# Altium project BMA_Projektv1.PrjPcb
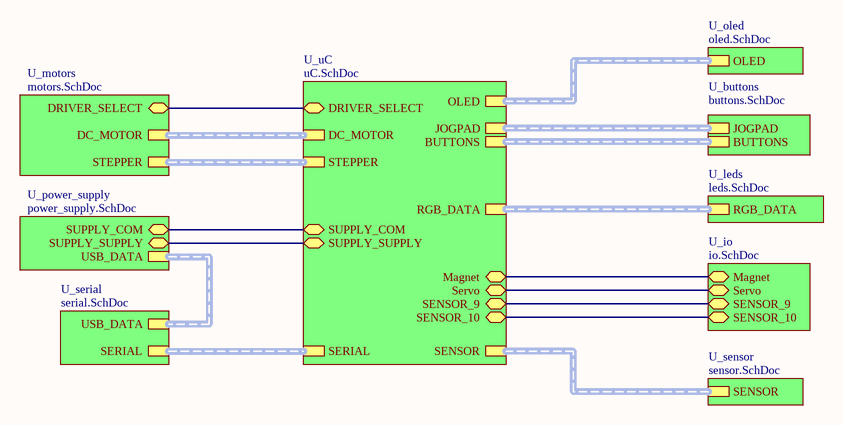
[diagram p0: BMAv1.0.SchDoc]
10 sheets, 159 parts. Net scope: hierarchical (ports join the sheet entries above them; power ports are global).
Board file: BMA_pcbv1.0.PcbDoc
Sheets:
  BMAv1.0.SchDoc
    U_uC = uC.SchDoc
    U_buttons = buttons.SchDoc
    U_io = io.SchDoc
    U_leds = leds.SchDoc
    U_motors = motors.SchDoc
    U_oled = oled.SchDoc
    U_power_supply = power_supply.SchDoc
    U_sensor = sensor.SchDoc
    U_serial = serial.SchDoc

## Sheet BMAv1.0.SchDoc
size A3

### Sub-sheets
U_buttons = buttons.SchDoc: BUTTONS (harness BUTTONS), JOGPAD (harness JOGPAD)
U_io = io.SchDoc: Magnet (bidir), Servo (bidir), SENSOR_9 (bidir), SENSOR_10 (bidir)
U_leds = leds.SchDoc: RGB_DATA (harness RGB_DATA)
U_motors = motors.SchDoc: DC_MOTOR (harness DC_MOTOR), STEPPER (harness STEPPER), DRIVER_SELECT (bidir)
U_oled = oled.SchDoc: OLED (harness OLED)
U_power_supply = power_supply.SchDoc: USB_DATA (harness USB_DATA), SUPPLY_SUPPLY (bidir), SUPPLY_COM (bidir)
U_sensor = sensor.SchDoc: SENSOR (harness SENSOR)
U_serial = serial.SchDoc: SERIAL (harness SERIAL), USB_DATA (harness USB_DATA)
U_uC = uC.SchDoc: STEPPER (harness STEPPER), DRIVER_SELECT (bidir), OLED (harness OLED), DC_MOTOR (harness DC_MOTOR), SUPPLY_COM (bidir), SUPPLY_SUPPLY (bidir), JOGPAD (harness JOGPAD), BUTTONS (harness BUTTONS), SERIAL (harness SERIAL), RGB_DATA (harness RGB_DATA), Magnet (bidir), Servo (bidir), SENSOR (harness SENSOR), SENSOR_9 (bidir), SENSOR_10 (bidir)

### Nets
NetC12_2: sheet U_uC/SENSOR_9, sheet U_io/SENSOR_9
NetC13_2: sheet U_uC/SENSOR_10, sheet U_io/SENSOR_10
NetP3_3: sheet U_uC/Magnet, sheet U_io/Magnet
NetP3_4: sheet U_uC/Servo, sheet U_io/Servo
NetP8_2: sheet U_uC/DRIVER_SELECT, sheet U_motors/DRIVER_SELECT
NetP23_1: sheet U_uC/SUPPLY_COM, sheet U_power_supply/SUPPLY_COM
NetP23_2: sheet U_uC/SUPPLY_SUPPLY, sheet U_power_supply/SUPPLY_SUPPLY

### Buses and harness runs
harness sheet U_buttons/BUTTONS = sheet U_uC/BUTTONS
harness sheet U_buttons/JOGPAD = sheet U_uC/JOGPAD
harness sheet U_leds/RGB_DATA = sheet U_uC/RGB_DATA
harness sheet U_motors/DC_MOTOR = sheet U_uC/DC_MOTOR
harness sheet U_motors/STEPPER = sheet U_uC/STEPPER
harness sheet U_oled/OLED = sheet U_uC/OLED
harness sheet U_power_supply/USB_DATA = sheet U_serial/USB_DATA
harness sheet U_sensor/SENSOR = sheet U_uC/SENSOR
harness sheet U_serial/SERIAL = sheet U_uC/SERIAL

### Notes on the sheet
- 1
- 2
- 3
- 4
- 5
- 6
- 7
- 8
- A
- B
- C
- D
- Project:
- Date:
- Drawing number:
- Rev:
- Format:
- A3
- Drawn by:
- Laboratory:
- Page
- Sheet:
- of
- File:

## Sheet uC.SchDoc
size A3
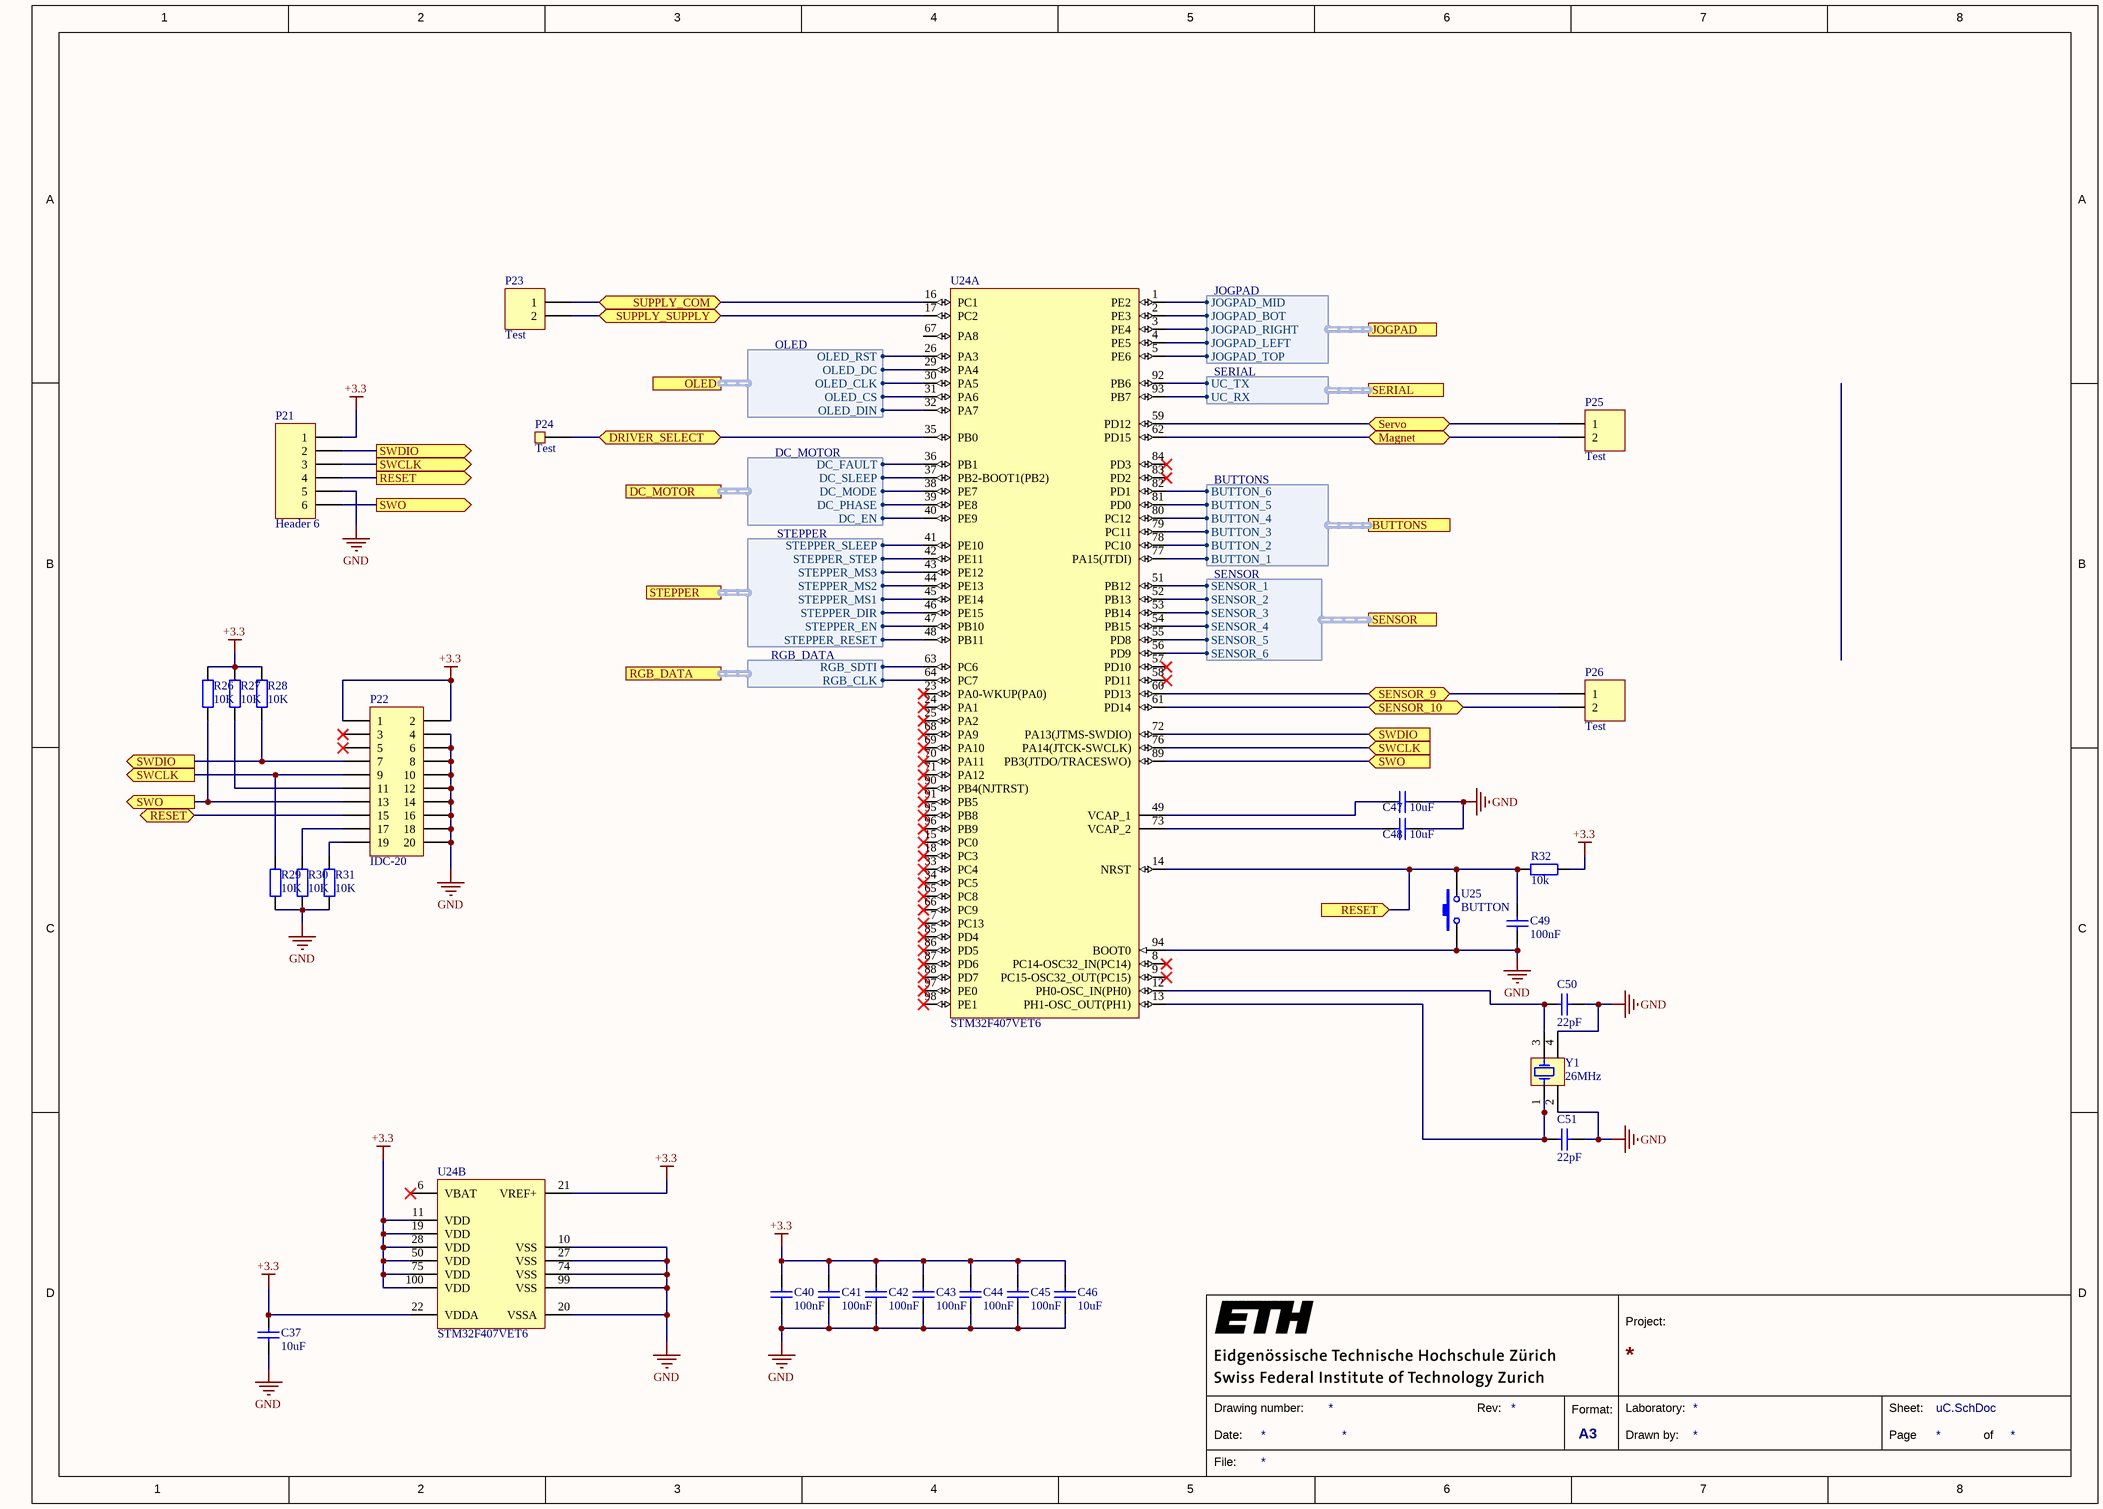
[diagram p1: uC.SchDoc]

### Parts
C37  10uF  [CAP_0603i_1608m -N]
C40  100nF  [CAP_0402i_1005m -N]
C41  100nF  [CAP_0402i_1005m -N]
C42  100nF  [CAP_0402i_1005m -N]
C43  100nF  [CAP_0402i_1005m -N]
C44  100nF  [CAP_0402i_1005m -N]
C45  100nF  [CAP_0402i_1005m -N]
C46  10uF  [CAP_0603i_1608m -N]
C47  10uF  [CAP_0603i_1608m -N]
C48  10uF  [CAP_0603i_1608m -N]
C49  100nF  [CAP_0402i_1005m -N]
C50  22pF  [CAP_0603i_1608m -N]
C51  22pF  [CAP_0603i_1608m -N]
P21  Header 6  [HDR1X6]
P22  IDC-20  [IDC-20]
P23  Test  [HDR1X2]
P24  Test  [PIN1]
P25  Test  [HDR1X2]
P26  Test  [HDR1X2]
R26  10K  [RES_0603i_1608m -N]
R27  10K  [RES_0603i_1608m -N]
R28  10K  [RES_0603i_1608m -N]
R29  10K  [RES_0603i_1608m -N]
R30  10K  [RES_0603i_1608m -N]
R31  10K  [RES_0603i_1608m -N]
R32  10k  [RES_0603i_1608m -N]
U24  STM32F407VET6  [STM-LQFP100_M]  (parts A,B of 2)
U25  BUTTON  [RND 210-00206]
Y1  26MHz  [TSX-3225 2*2.5]

### Ports
BUTTONS (harness BUTTONS), DC_MOTOR (harness DC_MOTOR), DRIVER_SELECT (bidir), JOGPAD (harness JOGPAD), Magnet (bidir), OLED (harness OLED), RESET (bidir), RESET (in), RESET (out), RGB_DATA (harness RGB_DATA), SENSOR (harness SENSOR), SENSOR_9 (bidir), SENSOR_10 (bidir), SERIAL (harness SERIAL), Servo (bidir), STEPPER (harness STEPPER), SUPPLY_COM (bidir), SUPPLY_SUPPLY (bidir), SWCLK (in), SWCLK (out), SWDIO (in), SWDIO (out), SWO (in), SWO (out)

### Harnesses
SENSOR: SENSOR_1, SENSOR_2, SENSOR_3, SENSOR_4, SENSOR_5, SENSOR_6
STEPPER: STEPPER_EN, STEPPER_STEP, STEPPER_MS1, STEPPER_MS2, STEPPER_MS3, STEPPER_DIR, STEPPER_RESET, STEPPER_SLEEP
DC_MOTOR: DC_SLEEP, DC_EN, DC_MODE, DC_PHASE, DC_FAULT
OLED: OLED_DIN, OLED_CLK, OLED_CS, OLED_DC, OLED_RST
JOGPAD: JOGPAD_TOP, JOGPAD_LEFT, JOGPAD_RIGHT, JOGPAD_BOT, JOGPAD_MID
BUTTONS: BUTTON_4, BUTTON_5, BUTTON_3, BUTTON_2, BUTTON_1, BUTTON_6
SERIAL: UC_RX, UC_TX
RGB_DATA: RGB_SDTI, RGB_CLK

### Nets
+3.3: C37.2 C40.1 C41.2 C42.2 C43.2 C44.2 C45.2 C46.2 P21.1 P22.1 P22.2 R26.2 R27.2 R28.2 R32.1 U24.11(VDD) U24.19(VDD) U24.21(VREF+) U24.22(VDDA) U24.28(VDD) U24.50(VDD) U24.75(VDD) U24.100(VDD)
GND: C37.1 C40.2 C41.1 C42.1 C43.1 C44.1 C45.1 C46.1 C47.1 C48.1 C49.1 C50.1 C51.1 P21.5 P22.4 P22.6 P22.8 P22.10 P22.12 P22.14 P22.16 P22.18 P22.20 R29.1 R30.1 R31.1 U24.10(VSS) U24.20(VSSA) U24.27(VSS) U24.74(VSS) U24.94(BOOT0) U24.99(VSS) U25.1 Y1.2(COM) Y1.4(COM)
NetC1_2: U24.1(PE2) ; port JOGPAD.JOGPAD_MID
NetC2_2: U24.2(PE3) ; port JOGPAD.JOGPAD_BOT
NetC3_2: U24.3(PE4) ; port JOGPAD.JOGPAD_RIGHT
NetC4_2: U24.4(PE5) ; port JOGPAD.JOGPAD_LEFT
NetC5_2: U24.5(PE6) ; port JOGPAD.JOGPAD_TOP
NetC6_2: U24.82(PD1) ; port BUTTONS.BUTTON_6
NetC7_2: U24.81(PD0) ; port BUTTONS.BUTTON_5
NetC8_2: U24.80(PC12) ; port BUTTONS.BUTTON_4
NetC9_2: U24.79(PC11) ; port BUTTONS.BUTTON_3
NetC10_2: U24.78(PC10) ; port BUTTONS.BUTTON_2
NetC11_2: U24.77(PA15(JTDI)) ; port BUTTONS.BUTTON_1
NetC12_2: P26.1 U24.60(PD13) ; port SENSOR_9
NetC13_2: P26.2 U24.61(PD14) ; port SENSOR_10
NetC29_2: U24.56(PD9) ; port SENSOR.SENSOR_6
NetC30_2: U24.55(PD8) ; port SENSOR.SENSOR_5
NetC31_2: U24.54(PB15) ; port SENSOR.SENSOR_4
NetC32_2: U24.53(PB14) ; port SENSOR.SENSOR_3
NetC33_2: U24.52(PB13) ; port SENSOR.SENSOR_2
NetC34_2: U24.51(PB12) ; port SENSOR.SENSOR_1
NetC47_2: C47.2 U24.49(VCAP_1)
NetC48_2: C48.2 U24.73(VCAP_2)
NetC49_2: C49.2 P21.4 P22.15 R32.2 U24.14(NRST) U25.2 ; port RESET
NetC50_2: C50.2 U24.12(PH0-OSC_IN(PH0)) Y1.3(OSC2)
NetC51_2: C51.2 U24.13(PH1-OSC_OUT(PH1)) Y1.1(OSC1)
NetIC1_1: U24.93(PB7) ; port SERIAL.UC_RX
NetIC1_5: U24.92(PB6) ; port SERIAL.UC_TX
NetP3_3: P25.2 U24.62(PD15) ; port Magnet
NetP3_4: P25.1 U24.59(PD12) ; port Servo
NetP5_1: U24.63(PC6) ; port RGB_DATA.RGB_SDTI
NetP5_2: U24.64(PC7) ; port RGB_DATA.RGB_CLK
NetP8_2: P24.1 U24.35(PB0) ; port DRIVER_SELECT
NetP21_2: P21.2 P22.7 R28.1 U24.72(PA13(JTMS-SWDIO)) ; port SWDIO
NetP21_3: P21.3 P22.9 R29.2 U24.76(PA14(JTCK-SWCLK)) ; port SWCLK
NetP21_6: P21.6 P22.13 R26.1 U24.89(PB3(JTDO/TRACESWO)) ; port SWO
NetP22_11: P22.11 R27.1
NetP22_17: P22.17 R30.2
NetP22_19: P22.19 R31.2
NetP23_1: P23.1 U24.16(PC1) ; port SUPPLY_COM
NetP23_2: P23.2 U24.17(PC2) ; port SUPPLY_SUPPLY
NetP27_3: U24.32(PA7) ; port OLED.OLED_DIN
NetP27_4: U24.30(PA5) ; port OLED.OLED_CLK
NetP27_5: U24.31(PA6) ; port OLED.OLED_CS
NetP27_6: U24.29(PA4) ; port OLED.OLED_DC
NetP27_7: U24.26(PA3) ; port OLED.OLED_RST
NetR3_1: U24.36(PB1) ; port DC_MOTOR.DC_FAULT
NetR6_1: U24.37(PB2-BOOT1(PB2)) ; port DC_MOTOR.DC_SLEEP
NetU14_2: U24.38(PE7) ; port DC_MOTOR.DC_MODE
NetU14_3: U24.39(PE8) ; port DC_MOTOR.DC_PHASE
NetU14_6: U24.40(PE9) ; port DC_MOTOR.DC_EN
NetU15_1: U24.47(PB10) ; port STEPPER.STEPPER_EN
NetU15_2: U24.45(PE14) ; port STEPPER.STEPPER_MS1
NetU15_3: U24.44(PE13) ; port STEPPER.STEPPER_MS2
NetU15_4: U24.43(PE12) ; port STEPPER.STEPPER_MS3
NetU15_5: U24.48(PB11) ; port STEPPER.STEPPER_RESET
NetU15_6: U24.41(PE10) ; port STEPPER.STEPPER_SLEEP
NetU15_7: U24.42(PE11) ; port STEPPER.STEPPER_STEP
NetU15_8: U24.46(PE15) ; port STEPPER.STEPPER_DIR

Not connected (* = marked no-connect by the designer): P22 3* 5*; U24 6(VBAT)* 7(PC13)* 8(PC14-OSC32_IN(PC14))* 9(PC15-OSC32_OUT(PC15))* 15(PC0)* 18(PC3)* 23(PA0-WKUP(PA0))* 24(PA1)* 25(PA2)* 33(PC4)* 34(PC5)* 57(PD10)* 58(PD11)* 65(PC8)* 66(PC9)* 67(PA8) 68(PA9)* 69(PA10)* 70(PA11)* 71(PA12)* 83(PD2)* 84(PD3)* 85(PD4)* 86(PD5)* 87(PD6)* 88(PD7)* 90(PB4(NJTRST))* 91(PB5)* 95(PB8)* 96(PB9)* 97(PE0)* 98(PE1)*

### Notes on the sheet
- 1
- 2
- 3
- 4
- 5
- 6
- 7
- 8
- A
- B
- C
- D
- Project:
- Date:
- Drawing number:
- Rev:
- Format:
- A3
- Drawn by:
- Laboratory:
- Page
- Sheet:
- of
- File:

### Library data of the parts
C37 C40-C51 = Cap: capacitor
P21 = Header 6: Header, 6-Pin
P22 = IDC-20: Connector; IDC, Male Header, Thru-Hole; 20 Position; Vertical; Pitch 2.54 mm; B
P23 P25 P26 = Header 2: Header, 2-Pin
P24 = Pad: Single Pad or Testpoint
R26-R32 = Res: Resistor
U24 = CMP-0243-00016-3: ARM Cortex-M4 32-bit MCU+FPU, 210 DMIPS, 512 kB Flash, 192 kB Internal RAM, 82 I/Os, 100-pin LQFP, -40 to 85 degC, Tray; Manufacturer: STMicroelectronics; Supply Voltage(Vcc) max (V): 3.6; Supply Voltage(Vcc) min (V): 1.8; I/Os (High Current): 82; FLASH Size (Prog) (kB): 512; Operating Frequency(F) (Processor speed) (MHz): 168; D/A Converter: 2x12-bit; Internal RAM Size (kB): 192; PackageReference: LQFP100; Core: ARM Cortex-M4; ComponentLink1URL: http://www.st.com/web/en/home.html; ComponentLink1Description: Manufacturer URL; DatasheetVersion: Rev. 4; Packing: Tray; Mounting Technology: Surface Mount; ComponentLink2Description: Datasheet; ComponentLink2URL: http://www.st.com/st-web-ui/static/active/en/resource/technical/document/datasheet/DM00037051.pdf; ComponentLink3Description: Package Specification; PartNumber: STM32F407VET6; PackageVersion: Rev. 1, 06/2013; PackageDescription: 100-Pin Low Profile Quad Flat Package, 14 x 14 mm Body, 0.5 mm Pitch; ComponentLink3URL: http://www.st.com/st-web-ui/static/active/en/resource/technical/document/data_brief/DM00071938.pdf
Y1 = XTAL3: Industrial Ceramic Resonator

## Sheet buttons.SchDoc
size A3
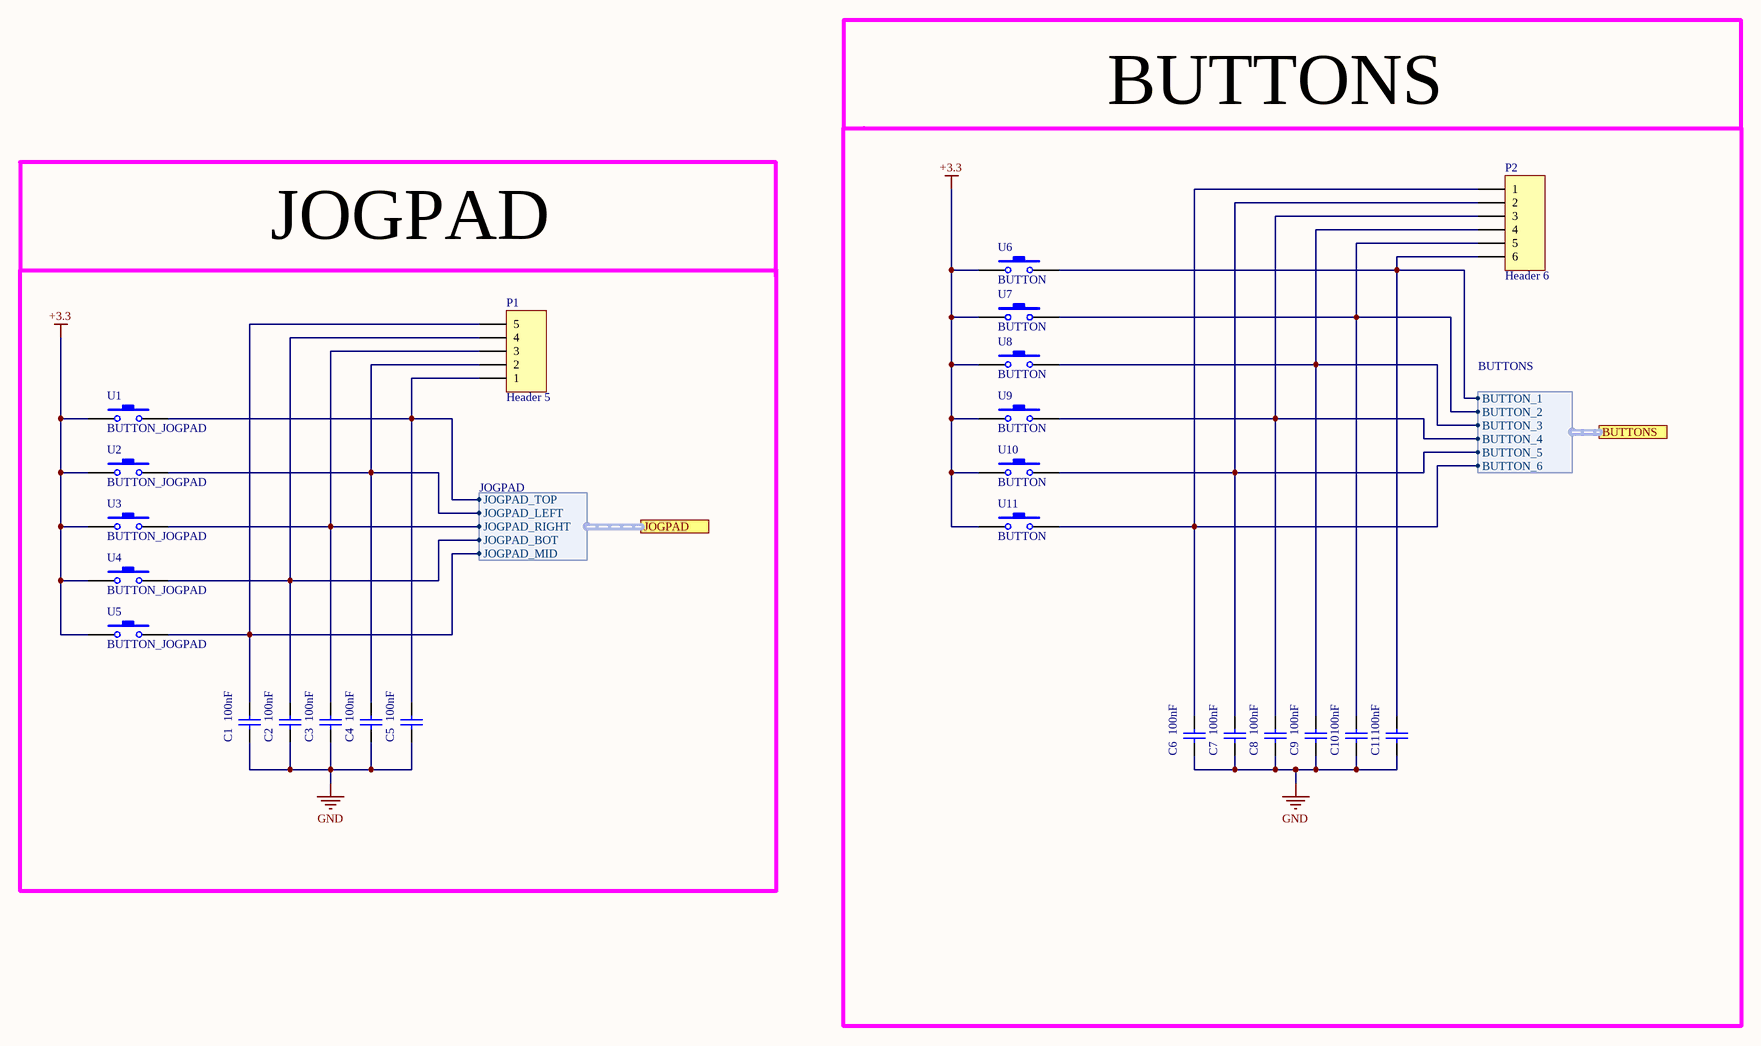
[diagram p2: buttons.SchDoc]

### Parts
C1  100nF  [CAP_0402i_1005m -N]
C2  100nF  [CAP_0402i_1005m -N]
C3  100nF  [CAP_0402i_1005m -N]
C4  100nF  [CAP_0402i_1005m -N]
C5  100nF  [CAP_0402i_1005m -N]
C6  100nF  [CAP_0402i_1005m -N]
C7  100nF  [CAP_0402i_1005m -N]
C8  100nF  [CAP_0402i_1005m -N]
C9  100nF  [CAP_0402i_1005m -N]
C10  100nF  [CAP_0402i_1005m -N]
C11  100nF  [CAP_0402i_1005m -N]
P1  Header 5  [HDR1X5]
P2  Header 6  [HDR1X6]
U1  BUTTON_JOGPAD  [JOGPAD_Button]
U2  BUTTON_JOGPAD  [JOGPAD_Button]
U3  BUTTON_JOGPAD  [JOGPAD_Button]
U4  BUTTON_JOGPAD  [JOGPAD_Button]
U5  BUTTON_JOGPAD  [JOGPAD_Button]
U6  BUTTON  [RND 210-00206]
U7  BUTTON  [RND 210-00206]
U8  BUTTON  [RND 210-00206]
U9  BUTTON  [RND 210-00206]
U10  BUTTON  [RND 210-00206]
U11  BUTTON  [RND 210-00206]

### Blocks framed on the sheet
BUTTONS: C6-C11 P2 U6-U11
JOGPAD: C1-C5 P1 U1-U5

### Ports
BUTTONS (harness BUTTONS), JOGPAD (harness JOGPAD)

### Harnesses
BUTTONS: BUTTON_4, BUTTON_5, BUTTON_3, BUTTON_2, BUTTON_1, BUTTON_6
JOGPAD: JOGPAD_TOP, JOGPAD_LEFT, JOGPAD_RIGHT, JOGPAD_BOT, JOGPAD_MID

### Nets
+3.3: U1.1 U2.1 U3.1 U4.1 U5.1 U6.1 U7.1 U8.1 U9.1 U10.1 U11.1
GND: C1.1 C2.1 C3.1 C4.1 C5.1 C6.1 C7.1 C8.1 C9.1 C10.1 C11.1
NetC1_2: C1.2 P1.5 U5.2 ; port JOGPAD.JOGPAD_MID
NetC2_2: C2.2 P1.4 U4.2 ; port JOGPAD.JOGPAD_BOT
NetC3_2: C3.2 P1.3 U3.2 ; port JOGPAD.JOGPAD_RIGHT
NetC4_2: C4.2 P1.2 U2.2 ; port JOGPAD.JOGPAD_LEFT
NetC5_2: C5.2 P1.1 U1.2 ; port JOGPAD.JOGPAD_TOP
NetC6_2: C6.2 P2.1 U11.2 ; port BUTTONS.BUTTON_6
NetC7_2: C7.2 P2.2 U10.2 ; port BUTTONS.BUTTON_5
NetC8_2: C8.2 P2.3 U9.2 ; port BUTTONS.BUTTON_4
NetC9_2: C9.2 P2.4 U8.2 ; port BUTTONS.BUTTON_3
NetC10_2: C10.2 P2.5 U7.2 ; port BUTTONS.BUTTON_2
NetC11_2: C11.2 P2.6 U6.2 ; port BUTTONS.BUTTON_1

### Notes on the sheet
- 1
- 2
- 3
- 4
- 5
- 6
- 7
- 8
- A
- B
- C
- D
- Project:
- Date:
- Drawing number:
- Rev:
- Format:
- A3
- Drawn by:
- Laboratory:
- Page
- Sheet:
- of
- File:

### Library data of the parts
C1-C11 = Cap: capacitor
P1 = Header 5: Header, 5-Pin
P2 = Header 6: Header, 6-Pin

## Sheet io.SchDoc
size A3
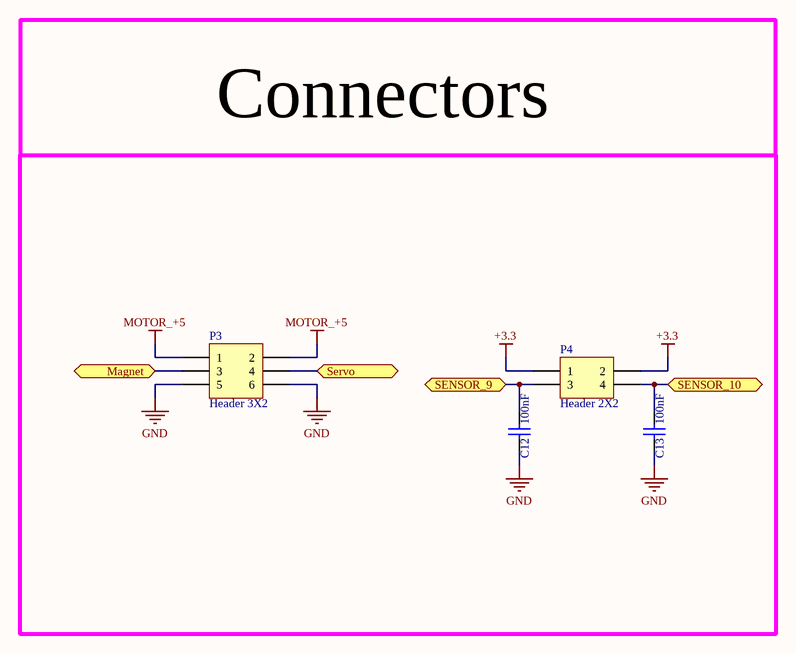
[diagram p3: io.SchDoc]

### Parts
C12  100nF  [CAP_0402i_1005m -N]
C13  100nF  [CAP_0402i_1005m -N]
P3  Header 3X2  [HDR2X3]
P4  Header 2X2  [HDR2X2]

### Ports
Magnet (bidir), SENSOR_9 (bidir), SENSOR_10 (bidir), Servo (bidir)

### Nets
+3.3: P4.1 P4.2
GND: C12.1 C13.1 P3.5 P3.6
MOTOR_+5: P3.1 P3.2
NetC12_2: C12.2 P4.3 ; port SENSOR_9
NetC13_2: C13.2 P4.4 ; port SENSOR_10
NetP3_3: P3.3 ; port Magnet
NetP3_4: P3.4 ; port Servo

### Notes on the sheet
- Connectors
- 1
- 2
- 3
- 4
- 5
- 6
- 7
- 8
- A
- B
- C
- D
- Project:
- Date:
- Drawing number:
- Rev:
- Format:
- A3
- Drawn by:
- Laboratory:
- Page
- Sheet:
- of
- File:

### Library data of the parts
C12 C13 = Cap: capacitor
P3 = Header 3X2: Header, 3-Pin, Dual row
P4 = Header 2X2: Header, 2-Pin, Dual row

## Sheet leds.SchDoc
size A3
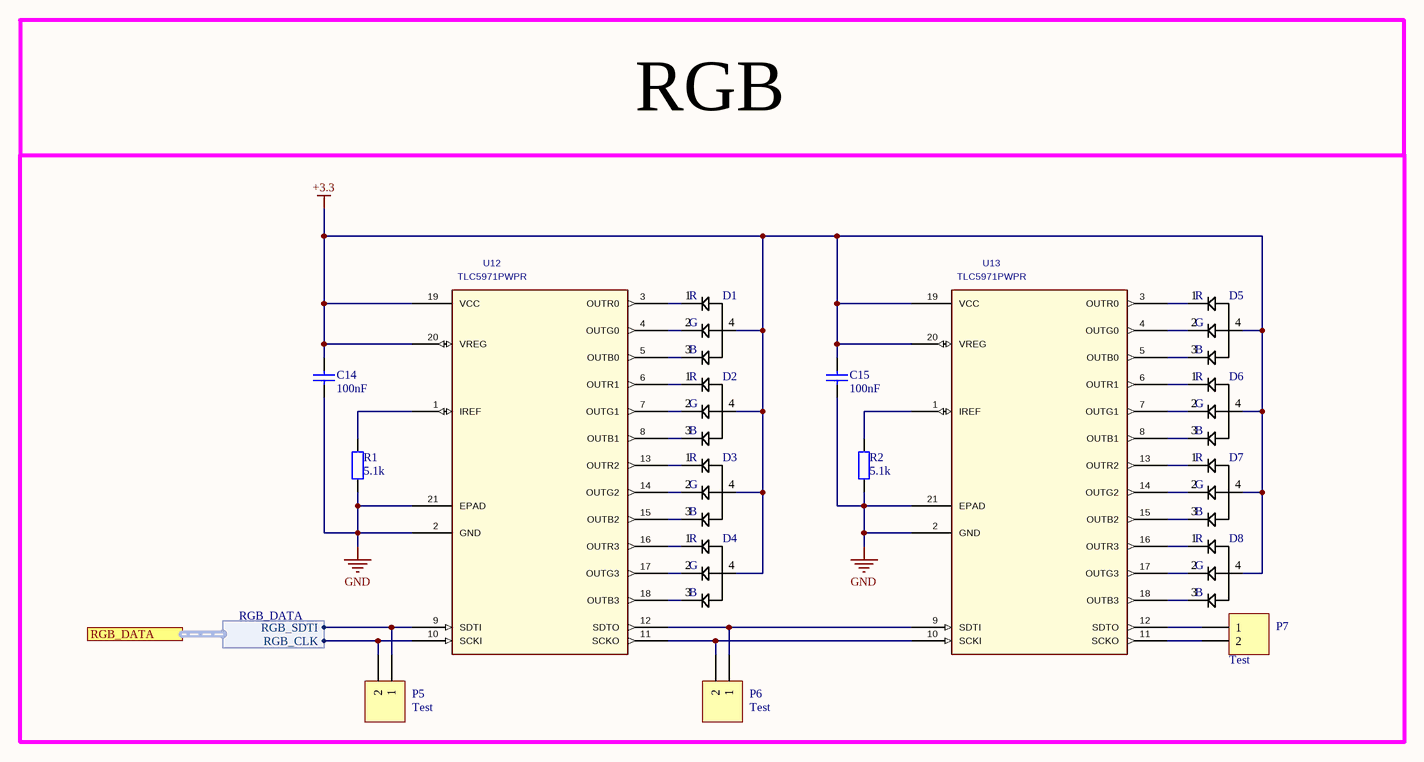
[diagram p4: leds.SchDoc]

### Parts
C14  100nF  [CAP_0402i_1005m -N]
C15  100nF  [CAP_0402i_1005m -N]
D1  67-23/R6GHBHC-B01/2T  [*PLCC-4]  (value not drawn)
D2  67-23/R6GHBHC-B01/2T  [*PLCC-4]  (value not drawn)
D3  67-23/R6GHBHC-B01/2T  [*PLCC-4]  (value not drawn)
D4  67-23/R6GHBHC-B01/2T  [*PLCC-4]  (value not drawn)
D5  67-23/R6GHBHC-B01/2T  [*PLCC-4]  (value not drawn)
D6  67-23/R6GHBHC-B01/2T  [*PLCC-4]  (value not drawn)
D7  67-23/R6GHBHC-B01/2T  [*PLCC-4]  (value not drawn)
D8  67-23/R6GHBHC-B01/2T  [*PLCC-4]  (value not drawn)
P5  Test  [HDR1X2]
P6  Test  [HDR1X2]
P7  Test  [HDR1X2]
R1  5.1k  [RES_0603i_1608m -N]
R2  5.1k  [RES_0603i_1608m -N]
U12  TLC5971PWPR  [PWP20_3P43X2P701]
U13  TLC5971PWPR  [PWP20_3P43X2P701]

### Ports
RGB_DATA (harness RGB_DATA)

### Harnesses
RGB_DATA: RGB_SDTI, RGB_CLK

### Nets
+3.3: C14.2 C15.2 D1.4(B14) D2.4(B14) D3.4(B14) D4.4(B14) D5.4(B14) D6.4(B14) D7.4(B14) D8.4(B14) U12.19(VCC) U12.20(VREG) U13.19(VCC) U13.20(VREG)
GND: C14.1 C15.1 R1.1 R2.1 U12.2(GND) U12.21(EPAD) U13.2(GND) U13.21(EPAD)
NetD1_1: D1.1(B15) U12.3(OUTR0)
NetD1_2: D1.2(B16) U12.4(OUTG0)
NetD1_3: D1.3(B17) U12.5(OUTB0)
NetD2_1: D2.1(B15) U12.6(OUTR1)
NetD2_2: D2.2(B16) U12.7(OUTG1)
NetD2_3: D2.3(B17) U12.8(OUTB1)
NetD3_1: D3.1(B15) U12.13(OUTR2)
NetD3_2: D3.2(B16) U12.14(OUTG2)
NetD3_3: D3.3(B17) U12.15(OUTB2)
NetD4_1: D4.1(B15) U12.16(OUTR3)
NetD4_2: D4.2(B16) U12.17(OUTG3)
NetD4_3: D4.3(B17) U12.18(OUTB3)
NetD5_1: D5.1(B15) U13.3(OUTR0)
NetD5_2: D5.2(B16) U13.4(OUTG0)
NetD5_3: D5.3(B17) U13.5(OUTB0)
NetD6_1: D6.1(B15) U13.6(OUTR1)
NetD6_2: D6.2(B16) U13.7(OUTG1)
NetD6_3: D6.3(B17) U13.8(OUTB1)
NetD7_1: D7.1(B15) U13.13(OUTR2)
NetD7_2: D7.2(B16) U13.14(OUTG2)
NetD7_3: D7.3(B17) U13.15(OUTB2)
NetD8_1: D8.1(B15) U13.16(OUTR3)
NetD8_2: D8.2(B16) U13.17(OUTG3)
NetD8_3: D8.3(B17) U13.18(OUTB3)
NetP5_1: P5.1 U12.9(SDTI) ; port RGB_DATA.RGB_SDTI
NetP5_2: P5.2 U12.10(SCKI) ; port RGB_DATA.RGB_CLK
NetP6_1: P6.1 U12.12(SDTO) U13.9(SDTI)
NetP6_2: P6.2 U12.11(SCKO) U13.10(SCKI)
NetP7_1: P7.1 U13.12(SDTO)
NetP7_2: P7.2 U13.11(SCKO)
NetR1_2: R1.2 U12.1(IREF)
NetR2_2: R2.2 U13.1(IREF)

### Notes on the sheet
- RGB
- 1
- 2
- 3
- 4
- 5
- 6
- 7
- 8
- A
- B
- C
- D
- Project:
- Date:
- Drawing number:
- Rev:
- Format:
- A3
- Drawn by:
- Laboratory:
- Page
- Sheet:
- of
- File:
- (in symbol 67-23/R6GHBHC-B01/2T) R; G; B

### Library data of the parts
C14 C15 = Cap: capacitor
P5-P7 = Header 2: Header, 2-Pin
R1 R2 = Res: Resistor
U12 U13 = TLC5971PWPR: C: Copyright (C) 2015 Accelerated Designs. All rights reserved; Vendor: Texas Instruments; Built_By: EMA_UL_Team; SourceLibrary: TI_2014-06-19; Value: TLC5971PWPR; Manufacturer_Part_Number: TLC5971PWPR; Manufacturer: Texas Instruments

## Sheet motors.SchDoc
size A3
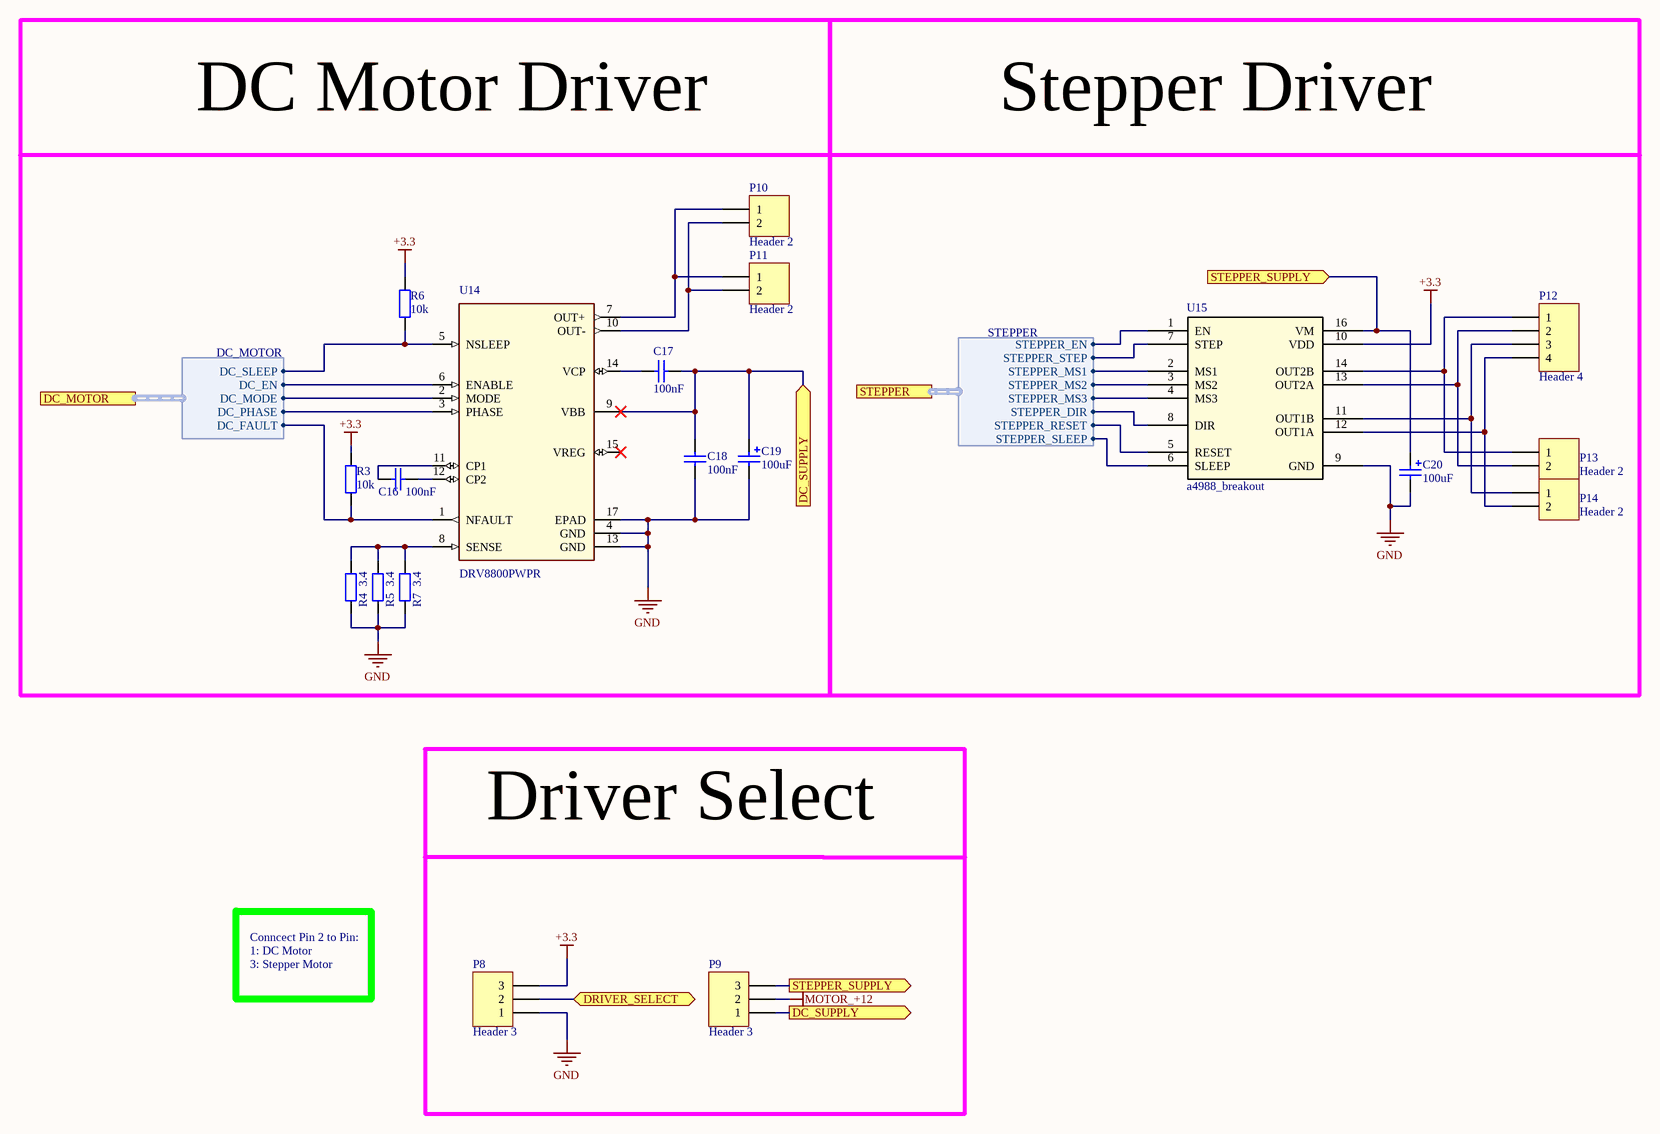
[diagram p5: motors.SchDoc]

### Parts
C16  100nF  [CAP_0603i_1608m -N]
C17  100nF  [CAP_0603i_1608m -N]
C18  100nF  [CAP_0603i_1608m -N]
C19  100uF  [Cap_F-Type-Package]
C20  100uF  [Cap_F-Type-Package]
P8  Header 3  [HDR1X3]
P9  Header 3  [HDR1X3]
P10  Header 2  [HDR1X2]
P11  Header 2  [3.5MM Phoenix Contact 1984617]
P12  Header 4  [HDR1X4]
P13  Header 2  [3.5MM Phoenix Contact 1984617]
P14  Header 2  [3.5MM Phoenix Contact 1984617]
R3  10k  [RES_0603i_1608m -N]
R4  3.4  [RES_1206i_C3216m -N]
R5  3.4  [RES_1206i_C3216m -N]
R6  10k  [RES_0603i_1608m -N]
R7  3.4  [RES_1206i_C3216m -N]
U14  DRV8800PWPR  [*SOP65P640X120-17N]
U15  a4988_breakout  [a4988_breakout]

### Ports
DC_MOTOR (harness DC_MOTOR), DC_SUPPLY (in), DC_SUPPLY (out), DRIVER_SELECT (bidir), STEPPER (harness STEPPER), STEPPER_SUPPLY (in), STEPPER_SUPPLY (out)

### Harnesses
DC_MOTOR: DC_SLEEP, DC_EN, DC_MODE, DC_PHASE, DC_FAULT
STEPPER: STEPPER_EN, STEPPER_STEP, STEPPER_MS1, STEPPER_MS2, STEPPER_MS3, STEPPER_DIR, STEPPER_RESET, STEPPER_SLEEP

### Nets
+3.3: P8.3 R3.2 R6.2 U15.10(VDD)
GND: C18.1 C19.2 C20.2 P8.1 R4.1 R5.1 R7.1 U14.4(GND) U14.13(GND) U14.17(EPAD) U15.9(GND)
MOTOR_+12: P9.2
NetC16_1: C16.1 U14.11(CP1)
NetC16_2: C16.2 U14.12(CP2)
NetC17_1: C17.1 C18.2 C19.1 P9.1 U14.9(VBB) ; port DC_SUPPLY
NetC17_2: C17.2 U14.14(VCP)
NetC20_1: C20.1 P9.3 U15.16(VM) ; port STEPPER_SUPPLY
NetP8_2: P8.2 ; port DRIVER_SELECT
NetP10_1: P10.1 P11.1 U14.7(OUT+)
NetP10_2: P10.2 P11.2 U14.10(OUT-)
NetP12_1: P12.1 P13.1 U15.14(OUT2B)
NetP12_2: P12.2 P13.2 U15.13(OUT2A)
NetP12_3: P12.3 P14.1 U15.11(OUT1B)
NetP12_4: P12.4 P14.2 U15.12(OUT1A)
NetR3_1: R3.1 U14.1(NFAULT) ; port DC_MOTOR.DC_FAULT
NetR4_2: R4.2 R5.2 R7.2 U14.8(SENSE)
NetR6_1: R6.1 U14.5(NSLEEP) ; port DC_MOTOR.DC_SLEEP
NetU14_2: U14.2(MODE) ; port DC_MOTOR.DC_MODE
NetU14_3: U14.3(PHASE) ; port DC_MOTOR.DC_PHASE
NetU14_6: U14.6(ENABLE) ; port DC_MOTOR.DC_EN
NetU15_1: U15.1(EN) ; port STEPPER.STEPPER_EN
NetU15_2: U15.2(MS1) ; port STEPPER.STEPPER_MS1
NetU15_3: U15.3(MS2) ; port STEPPER.STEPPER_MS2
NetU15_4: U15.4(MS3) ; port STEPPER.STEPPER_MS3
NetU15_5: U15.5(RESET) ; port STEPPER.STEPPER_RESET
NetU15_6: U15.6(SLEEP) ; port STEPPER.STEPPER_SLEEP
NetU15_7: U15.7(STEP) ; port STEPPER.STEPPER_STEP
NetU15_8: U15.8(DIR) ; port STEPPER.STEPPER_DIR

Not connected (* = marked no-connect by the designer): U14 15(VREG)*

### Notes on the sheet
- DC Motor Driver
- Stepper Driver
- Driver Select
- Conncect Pin 2 to Pin:
- 1: DC Motor
- 3: Stepper Motor
- 1
- 2
- 3
- 4
- 5
- 6
- 7
- 8
- A
- B
- C
- D
- Project:
- Date:
- Drawing number:
- Rev:
- Format:
- A3
- Drawn by:
- Laboratory:
- Page
- Sheet:
- of
- File:

### Library data of the parts
C16-C18 = Cap: capacitor
C19 C20 = Cap pol: Polarised capacitor (e.g. Electrolytic )
P8 P9 = Header 3: Header, 3-Pin
P10 P11 P13 P14 = Header 2: Header, 2-Pin
P12 = Header 4: Header, 4-Pin
R3-R7 = Res: Resistor
U14 = DRV8800PWPR: SnapEDA_Link: https://www.snapeda.com/parts/DRV8800PWPR/Texas%20Instruments/view-part/230050/?ref=snap; Value: *

## Sheet oled.SchDoc
size A3
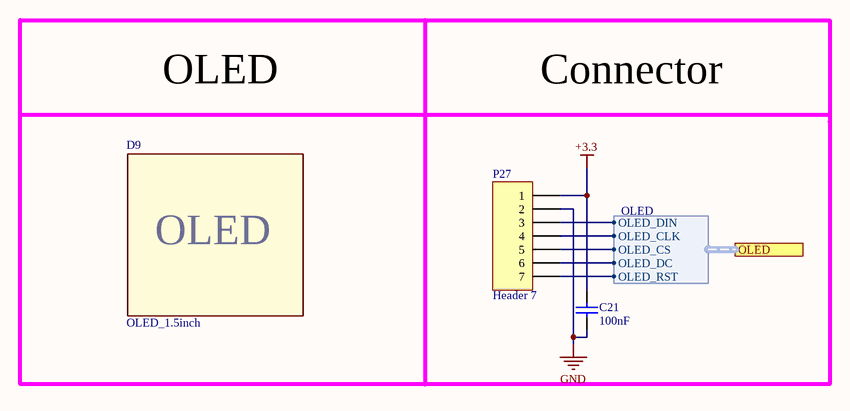
[diagram p6: oled.SchDoc]

### Parts
C21  100nF  [CAP_0402i_1005m -N]
D9  OLED_1.5inch  [oled_1.5inch]
P27  Header 7  [HDR1X7]

### Blocks framed on the sheet
OLED: D9

### Ports
OLED (harness OLED)

### Harnesses
OLED: OLED_DIN, OLED_CLK, OLED_CS, OLED_DC, OLED_RST

### Nets
+3.3: C21.1 P27.1
GND: C21.2 P27.2
NetP27_3: P27.3 ; port OLED.OLED_DIN
NetP27_4: P27.4 ; port OLED.OLED_CLK
NetP27_5: P27.5 ; port OLED.OLED_CS
NetP27_6: P27.6 ; port OLED.OLED_DC
NetP27_7: P27.7 ; port OLED.OLED_RST

### Notes on the sheet
- Connector
- 1
- 2
- 3
- 4
- 5
- 6
- 7
- 8
- A
- B
- C
- D
- Project:
- Date:
- Drawing number:
- Rev:
- Format:
- A3
- Drawn by:
- Laboratory:
- Page
- Sheet:
- of
- File:
- (in symbol OLED_1.5inch) OLED

### Library data of the parts
C21 = Cap: capacitor
D9 = OLED_1.5inch: 128x128 1.5inch RGB OLED Display Modul SPI
P27 = Header 7: Header, 7-Pin

## Sheet power_supply.SchDoc
size A3
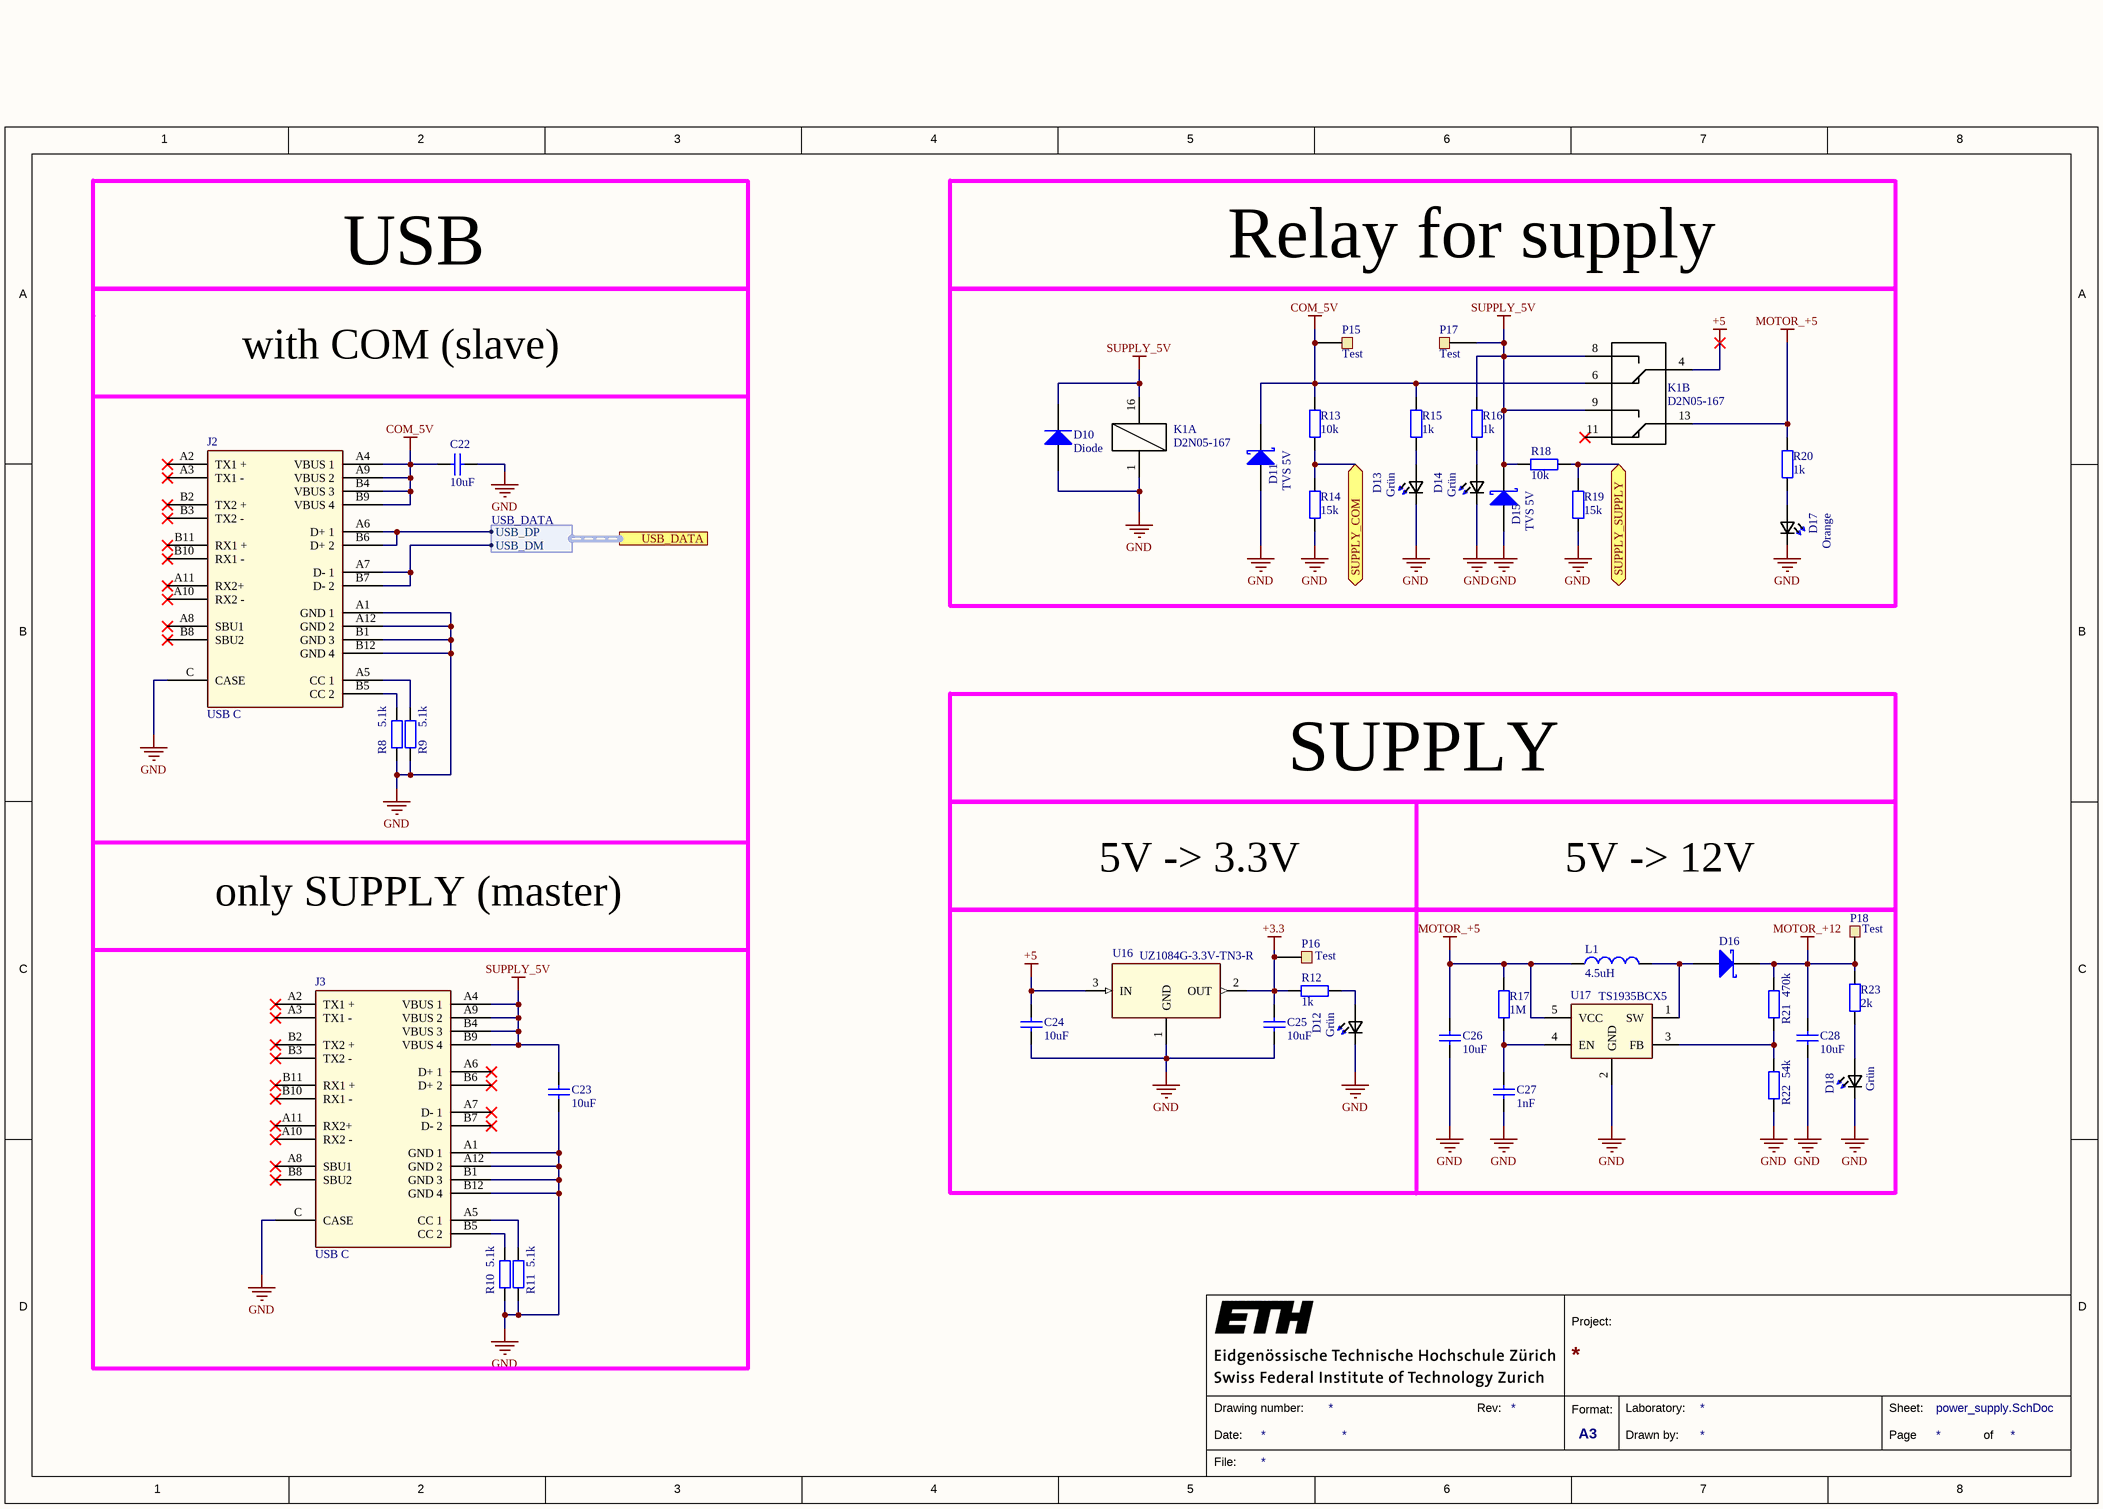
[diagram p7: power_supply.SchDoc]

### Parts
C22  10uF  [CAP_0603i_1608m -L]
C23  10uF  [CAP_0603i_1608m -L]
C24  10uF  [CAP_0603i_1608m -L]
C25  10uF  [CAP_0603i_1608m -L]
C26  10uF  [CAP_0603i_1608m -L]
C27  1nF  [CAP_0402i_1005m -N]
C28  10uF  [CAP_0603i_1608m -L]
D10  Diode  [SOD-323-N]
D11  TVS 5V  [SOD123]
D12  Grün  [*0603]
D13  Grün  [*0603]
D14  Grün  [*0603]
D15  TVS 5V  [SOD123]
D16  Diode  Schottky  [Diode SMA DO-214AC -N]  (value not drawn)
D17  Orange  [*0603]
D18  Grün  [*0603]
J2  USB C  [80211-1921]
J3  USB C  [80211-1921]
K1  D2N05-167  [D2N05-167]  (parts A,B of 2)
L1  4.5uH  [IND_0603i_1608m -L]
P15  Test  [PIN1]
P16  Test  [PIN1]
P17  Test  [PIN1]
P18  Test  [PIN1]
R8  5.1k  [RES_0603i_1608m -N]
R9  5.1k  [RES_0603i_1608m -N]
R10  5.1k  [RES_0603i_1608m -N]
R11  5.1k  [RES_0603i_1608m -N]
R12  1k  [RES_0603i_1608m -N]
R13  10k  [RES_0603i_1608m -N]
R14  15k  [RES_0603i_1608m -N]
R15  1k  [RES_0603i_1608m -N]
R16  1k  [RES_0603i_1608m -N]
R17  1M  [RES_0603i_1608m -N]
R18  10k  [RES_0603i_1608m -N]
R19  15k  [RES_0603i_1608m -N]
R20  1k  [RES_0603i_1608m -N]
R21  470k  [RES_0603i_1608m -N]
R22  54k  [RES_0603i_1608m -N]
R23  2k  [RES_0603i_1608m -N]
U16  UZ1084G-3.3V-TN3-R  [TO-252-2]
U17  TS1935BCX5  [*SOT95P285X145-5N]

### Blocks framed on the sheet
Relay for supply: D10 D11 D13-D15 D17 K1 P15 P17 R13-R16 R18-R20

### Ports
SUPPLY_COM (bidir), SUPPLY_SUPPLY (bidir), USB_DATA (harness USB_DATA)

### Harnesses
USB_DATA: USB_DP, USB_DM

### Nets
+3.3: C25.2 P16.1 R12.2 U16.2(OUT)
+5: C24.2 K1.4 U16.3(IN)
COM_5V: C22.2 D11.2(K) J2.A4(VBUS_1) J2.A9(VBUS_2) J2.B4(VBUS_3) J2.B9(VBUS_4) K1.6 P15.1 R13.2 R15.2
GND: C22.1 C23.2 C24.1 C25.1 C26.1 C27.1 C28.1 D10.1(A) D11.1(A) D12.1(K2) D13.1(K2) D14.1(K2) D15.1(A) D17.1(K2) D18.1(K2) J2.A1(GND_1) J2.A12(GND_2) J2.B1(GND_3) J2.B12(GND_4) J2.C(CASE) J3.A1(GND_1) J3.A12(GND_2) J3.B1(GND_3) J3.B12(GND_4) J3.C(CASE) K1.1 R8.2 R9.2 R10.2 R11.2 R14.1 R19.1 R22.2 U16.1(GND) U17.2(GND)
MOTOR_+5: C26.2 K1.13 L1.1 R17.1 R20.2 U17.5(VCC)
MOTOR_+12: C28.2 D16.2(K) P18.1 R21.1 R23.2
SUPPLY_5V: C23.1 D10.2(K) D15.2(K) J3.A4(VBUS_1) J3.A9(VBUS_2) J3.B4(VBUS_3) J3.B9(VBUS_4) K1.8 K1.9 K1.16 P17.1 R16.2 R18.1
NetC27_2: C27.2 R17.2 U17.4(EN)
NetD12_2: D12.2(A2) R12.1
NetD13_2: D13.2(A2) R15.1
NetD14_2: D14.2(A2) R16.1
NetD16_1: D16.1(A) L1.2 U17.1(SW)
NetD17_2: D17.2(A2) R20.1
NetD18_2: D18.2(A2) R23.1
NetIC1_15: J2.A6(D+_1) J2.B6(D+_2) ; port USB_DATA.USB_DP
NetIC1_16: J2.A7(D-_1) J2.B7(D-_2) ; port USB_DATA.USB_DM
NetJ2_A5: J2.A5(CC_1) R9.1
NetJ2_B5: J2.B5(CC_2) R8.1
NetJ3_A5: J3.A5(CC_1) R11.1
NetJ3_B5: J3.B5(CC_2) R10.1
NetP23_1: R13.1 R14.2 ; port SUPPLY_COM
NetP23_2: R18.2 R19.2 ; port SUPPLY_SUPPLY
NetR21_2: R21.2 R22.1 U17.3(FB)

Not connected (* = marked no-connect by the designer): J2 A2(TX1_+)* A3(TX1_-)* A8(SBU1)* A10(RX2_-)* A11(RX2+)* B2(TX2_+)* B3(TX2_-)* B8(SBU2)* B10(RX1_-)* B11(RX1_+)*; J3 A2(TX1_+)* A3(TX1_-)* A6(D+_1)* A7(D-_1)* A8(SBU1)* A10(RX2_-)* A11(RX2+)* B2(TX2_+)* B3(TX2_-)* B6(D+_2)* B7(D-_2)* B8(SBU2)* B10(RX1_-)* B11(RX1_+)*; K1 11*

### Notes on the sheet
- USB
- with COM (slave)
- SUPPLY
- only SUPPLY (master)
- 5V -> 3.3V
- 5V -> 12V
- 1
- 2
- 3
- 4
- 5
- 6
- 7
- 8
- A
- B
- C
- D
- Project:
- Date:
- Drawing number:
- Rev:
- Format:
- A3
- Drawn by:
- Laboratory:
- Page
- Sheet:
- of
- File:

### Library data of the parts
C22-C28 = Cap: capacitor
D10 = Diode: Default Diode
D11 D15 = Diode  Schottky: TVS Diode
D12-D14 D18 = LTST-C191KGKT: / LED; SMD; 0603; grün; 35mcd; 1.6x0.8x0.55mm; 130Â°; 2Ã·2.V; 20mA /; MF: Lite-On Inc.; Digi-Key_Purchase_URL: https://www.digikey.ch/product-detail/de/lite-on-inc/LTST-C191KGKT/160-1446-1-ND/386834; SnapEDA_Link: https://www.snapeda.com/parts/LTST-C191KFKT/Lite-On%20Inc./view-part/?ref=snap; MP: LTST-C191KGKT; Digi-Key_Part_Number: 160-1446-1-ND; Package: 0603 Lite-On; Value: *
D16 = Diode  Schottky: Schottky Diode
D17 = LTST-C191KFKT: / LED; SMD; 0603; orange; 45-90mcd; 1.6x0.8x0.55mm; 130Â°; 2Ã·2.4V; 20mA /; MF: Lite-On Inc.; Digi-Key_Purchase_URL: https://www.digikey.com/product-detail/en/lite-on-inc/LTST-C191KFKT/160-1445-1-ND/386832?utm_source=snapeda&utm_medium=aggregator&utm_campaign=symbol; SnapEDA_Link: https://www.snapeda.com/parts/LTST-C191KFKT/Lite-On%20Inc./view-part/?ref=snap; MP: LTST-C191KFKT; Digi-Key_Part_Number: 160-1445-1-ND; Package: 0603 Lite-On; Value: *
L1 = Inductor
P15-P18 = Pad: Single Pad or Testpoint
R8 R10 R12 R15 R16 R20 R23 = Res: Resistor
R9 R11 R13 R14 R17-R19 R21 R22 = Res
U16 = UZ1084G-3.3V-TN3-R: LINEAR VOLTAGE REGULATORS TO-252-2(DPAK) ROHS; MF: Diodes Inc.; MP: AZ1117D-3.3TRE1; Availability: Unavailable; SnapEDA_Link: https://www.snapeda.com/parts/AZ1117D-3.3TRE1/Diodes%20Inc./view-part/856390/?ref=snap; Package: TO-252-2 Diodes Inc.; Price: None; Value: *
U17 = TS1935BCX5: TS1935BCX5 Boost-Schaltregler Adj 1,9A 2,6-5,5Vi SOT23-5

## Sheet sensor.SchDoc
size A3
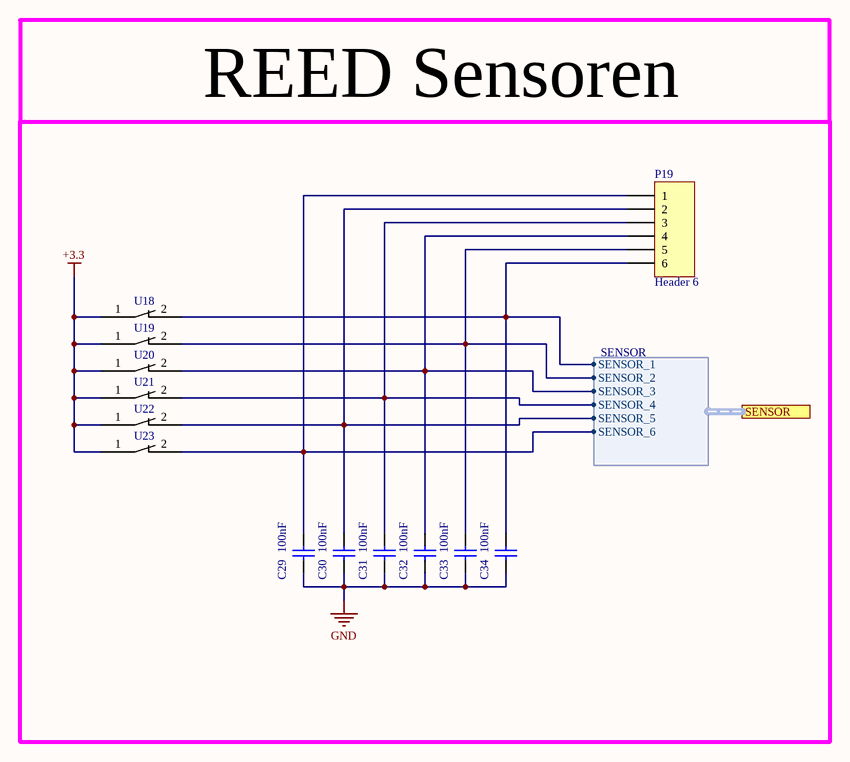
[diagram p8: sensor.SchDoc]

### Parts
C29  100nF  [CAP_0402i_1005m -N]
C30  100nF  [CAP_0402i_1005m -N]
C31  100nF  [CAP_0402i_1005m -N]
C32  100nF  [CAP_0402i_1005m -N]
C33  100nF  [CAP_0402i_1005m -N]
C34  100nF  [CAP_0402i_1005m -N]
P19  Header 6  [HDR1X6]
U18  reed_sensor  [MK 65B]  (value not drawn)
U19  reed_sensor  [MK 65B]  (value not drawn)
U20  reed_sensor  [MK 65B]  (value not drawn)
U21  reed_sensor  [MK 65B]  (value not drawn)
U22  reed_sensor  [MK 65B]  (value not drawn)
U23  reed_sensor  [MK 65B]  (value not drawn)

### Blocks framed on the sheet
REED Sensoren: C29-C34 P19 U18-U23

### Ports
SENSOR (harness SENSOR)

### Harnesses
SENSOR: SENSOR_1, SENSOR_2, SENSOR_3, SENSOR_4, SENSOR_5, SENSOR_6

### Nets
+3.3: U18.1 U19.1 U20.1 U21.1 U22.1 U23.1
GND: C29.1 C30.1 C31.1 C32.1 C33.1 C34.1
NetC29_2: C29.2 P19.1 U23.2 ; port SENSOR.SENSOR_6
NetC30_2: C30.2 P19.2 U22.2 ; port SENSOR.SENSOR_5
NetC31_2: C31.2 P19.3 U21.2 ; port SENSOR.SENSOR_4
NetC32_2: C32.2 P19.4 U20.2 ; port SENSOR.SENSOR_3
NetC33_2: C33.2 P19.5 U19.2 ; port SENSOR.SENSOR_2
NetC34_2: C34.2 P19.6 U18.2 ; port SENSOR.SENSOR_1

### Notes on the sheet
- 1
- 2
- 3
- 4
- 5
- 6
- 7
- 8
- A
- B
- C
- D
- Project:
- Date:
- Drawing number:
- Rev:
- Format:
- A3
- Drawn by:
- Laboratory:
- Page
- Sheet:
- of
- File:

### Library data of the parts
C29-C34 = Cap: capacitor
P19 = Header 6: Header, 6-Pin

## Sheet serial.SchDoc
size A3
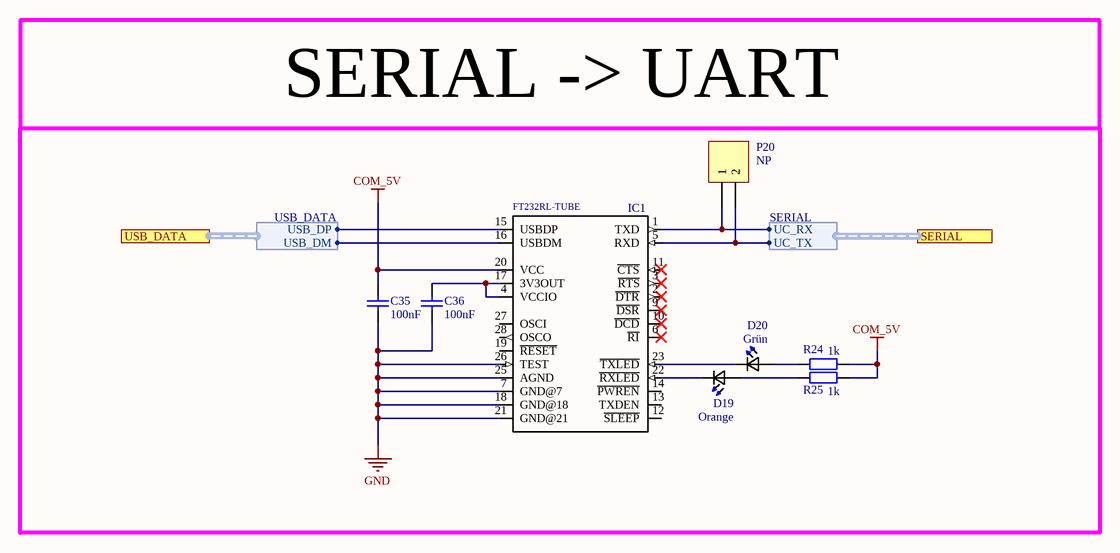
[diagram p9: serial.SchDoc]

### Parts
C35  100nF  [CAP_0402i_1005m -N]
C36  100nF  [CAP_0402i_1005m -N]
D19  Orange  [*0603]
D20  Grün  [*0603]
IC1  FT232RL-TUBE  [*SSOP28-LD]  (value not drawn)
P20  NP  [HDR1X2]
R24  1k  [RES_0603i_1608m -N]
R25  1k  [RES_0603i_1608m -N]

### Blocks framed on the sheet
SERIAL -> UART: C35 C36 D19 D20 IC1 P20 R24 R25

### Ports
SERIAL (harness SERIAL), USB_DATA (harness USB_DATA)

### Harnesses
SERIAL: UC_RX, UC_TX
USB_DATA: USB_DP, USB_DM

### Nets
COM_5V: C35.2 IC1.20(VCC) R24.2 R25.2
GND: C35.1 C36.1 IC1.7(GND@7) IC1.18(GND@18) IC1.21(GND@21) IC1.25(AGND) IC1.26(TEST)
NetC36_2: C36.2 IC1.4(VCCIO) IC1.17(3V3OUT)
NetD19_1: D19.1(K2) IC1.22(~{RXLED})
NetD19_2: D19.2(A2) R25.1
NetD20_1: D20.1(K2) IC1.23(~{TXLED})
NetD20_2: D20.2(A2) R24.1
NetIC1_1: IC1.1(TXD) P20.1 ; port SERIAL.UC_RX
NetIC1_5: IC1.5(RXD) P20.2 ; port SERIAL.UC_TX
NetIC1_15: IC1.15(USBDP) ; port USB_DATA.USB_DP
NetIC1_16: IC1.16(USBDM) ; port USB_DATA.USB_DM

Not connected (* = marked no-connect by the designer): IC1 2(~{DTR})* 3(~{RTS})* 6(~{RI})* 9(~{DSR})* 10(~{DCD})* 11(~{CTS})* 12(~{SLEEP}) 13(TXDEN) 14(~{PWREN}) 19(~{RESET}) 27(OSCI) 28(OSCO)

### Notes on the sheet
- 1
- 2
- 3
- 4
- 5
- 6
- 7
- 8
- A
- B
- C
- D
- Project:
- Date:
- Drawing number:
- Rev:
- Format:
- A3
- Drawn by:
- Laboratory:
- Page
- Sheet:
- of
- File:

### Library data of the parts
C35 C36 = Cap: capacitor
D19 = LTST-C191KFKT: as D17 on sheet power_supply; Digi-Key_Purchase_URL: https://www.digikey.com/product-detail/en/lite-on-inc/LTST-C191KFKT/160-1445-1-ND/386832?utm_source=snapeda&utm_medium=aggregator&utm_campaign=symbol; SnapEDA_Link: https://www.snapeda.com/parts/LTST-C191KFKT/Lite-On%20Inc./view-part/?ref=snap; MP: LTST-C191KFKT; Digi-Key_Part_Number: 160-1445-1-ND; Package: 0603 Lite-On; Value: *
D20 = LTST-C191KGKT: as D12 on sheet power_supply; Digi-Key_Purchase_URL: https://www.digikey.ch/product-detail/de/lite-on-inc/LTST-C191KGKT/160-1446-1-ND/386834; SnapEDA_Link: https://www.snapeda.com/parts/LTST-C191KFKT/Lite-On%20Inc./view-part/?ref=snap; MP: LTST-C191KGKT; Digi-Key_Part_Number: 160-1446-1-ND; Package: 0603 Lite-On; Value: *
IC1 = FT232RL-TUBE: USB-to-UART 1-CH 256byte FIFO 5V 28-Pin SSOP Tube; MF: FTDI,; Digi-Key_Part_Number: 768-1306-ND; Package: SSOP-28 FTDI; Digi-Key_Purchase_URL: https://www.digikey.com/product-detail/en/ftdi-future-technology-devices-international-ltd/FT232RL-TUBE/768-1306-ND/4006920?utm_source=snapeda&utm_medium=aggregator&utm_campaign=symbol; SnapEDA_Link: https://www.snapeda.com/parts/FT232RL-TUBE/FTDI%2C%20Future%20Technology%20Devices%20International%20Ltd/view-part/?ref=snap; MP: FT232RL-TUBE; Value: *
P20 = Header 2: Header, 2-Pin
R24 R25 = Res: Resistor

## Nets that join several sheets
+3.3: uC (23 pins), buttons (11 pins), io (P4.1 P4.2), leds (14 pins), motors (P8.3 R3.2 R6.2 U15.10), oled (C21.1 P27.1), power_supply (C25.2 P16.1 R12.2 U16.2), sensor (6 pins)
COM_5V: power_supply (10 pins), serial (C35.2 IC1.20 R24.2 R25.2)
GND: uC (35 pins), buttons (11 pins), io (C12.1 C13.1 P3.5 P3.6), leds (8 pins), motors (11 pins), oled (C21.2 P27.2), power_supply (35 pins), sensor (6 pins), serial (7 pins)
MOTOR_+5: io (P3.1 P3.2), power_supply (6 pins)
MOTOR_+12: motors (P9.2), power_supply (5 pins)
NetC1_2: uC (U24.1), buttons (C1.2 P1.5 U5.2)
NetC2_2: uC (U24.2), buttons (C2.2 P1.4 U4.2)
NetC3_2: uC (U24.3), buttons (C3.2 P1.3 U3.2)
NetC4_2: uC (U24.4), buttons (C4.2 P1.2 U2.2)
NetC5_2: uC (U24.5), buttons (C5.2 P1.1 U1.2)
NetC6_2: uC (U24.82), buttons (C6.2 P2.1 U11.2)
NetC7_2: uC (U24.81), buttons (C7.2 P2.2 U10.2)
NetC8_2: uC (U24.80), buttons (C8.2 P2.3 U9.2)
NetC9_2: uC (U24.79), buttons (C9.2 P2.4 U8.2)
NetC10_2: uC (U24.78), buttons (C10.2 P2.5 U7.2)
NetC11_2: uC (U24.77), buttons (C11.2 P2.6 U6.2)
NetC12_2: uC (P26.1 U24.60), io (C12.2 P4.3)
NetC13_2: uC (P26.2 U24.61), io (C13.2 P4.4)
NetC29_2: uC (U24.56), sensor (C29.2 P19.1 U23.2)
NetC30_2: uC (U24.55), sensor (C30.2 P19.2 U22.2)
NetC31_2: uC (U24.54), sensor (C31.2 P19.3 U21.2)
NetC32_2: uC (U24.53), sensor (C32.2 P19.4 U20.2)
NetC33_2: uC (U24.52), sensor (C33.2 P19.5 U19.2)
NetC34_2: uC (U24.51), sensor (C34.2 P19.6 U18.2)
NetIC1_1: uC (U24.93), serial (IC1.1 P20.1)
NetIC1_5: uC (U24.92), serial (IC1.5 P20.2)
NetIC1_15: power_supply (J2.A6 J2.B6), serial (IC1.15)
NetIC1_16: power_supply (J2.A7 J2.B7), serial (IC1.16)
NetP3_3: uC (P25.2 U24.62), io (P3.3)
NetP3_4: uC (P25.1 U24.59), io (P3.4)
NetP5_1: uC (U24.63), leds (P5.1 U12.9)
NetP5_2: uC (U24.64), leds (P5.2 U12.10)
NetP8_2: uC (P24.1 U24.35), motors (P8.2)
NetP23_1: uC (P23.1 U24.16), power_supply (R13.1 R14.2)
NetP23_2: uC (P23.2 U24.17), power_supply (R18.2 R19.2)
NetP27_3: uC (U24.32), oled (P27.3)
NetP27_4: uC (U24.30), oled (P27.4)
NetP27_5: uC (U24.31), oled (P27.5)
NetP27_6: uC (U24.29), oled (P27.6)
NetP27_7: uC (U24.26), oled (P27.7)
NetR3_1: uC (U24.36), motors (R3.1 U14.1)
NetR6_1: uC (U24.37), motors (R6.1 U14.5)
NetU14_2: uC (U24.38), motors (U14.2)
NetU14_3: uC (U24.39), motors (U14.3)
NetU14_6: uC (U24.40), motors (U14.6)
NetU15_1: uC (U24.47), motors (U15.1)
NetU15_2: uC (U24.45), motors (U15.2)
NetU15_3: uC (U24.44), motors (U15.3)
NetU15_4: uC (U24.43), motors (U15.4)
NetU15_5: uC (U24.48), motors (U15.5)
NetU15_6: uC (U24.41), motors (U15.6)
NetU15_7: uC (U24.42), motors (U15.7)
NetU15_8: uC (U24.46), motors (U15.8)